# EAGLE schematic Design2 (EAGLE 9.5.0)

## Sheet 1 of 2
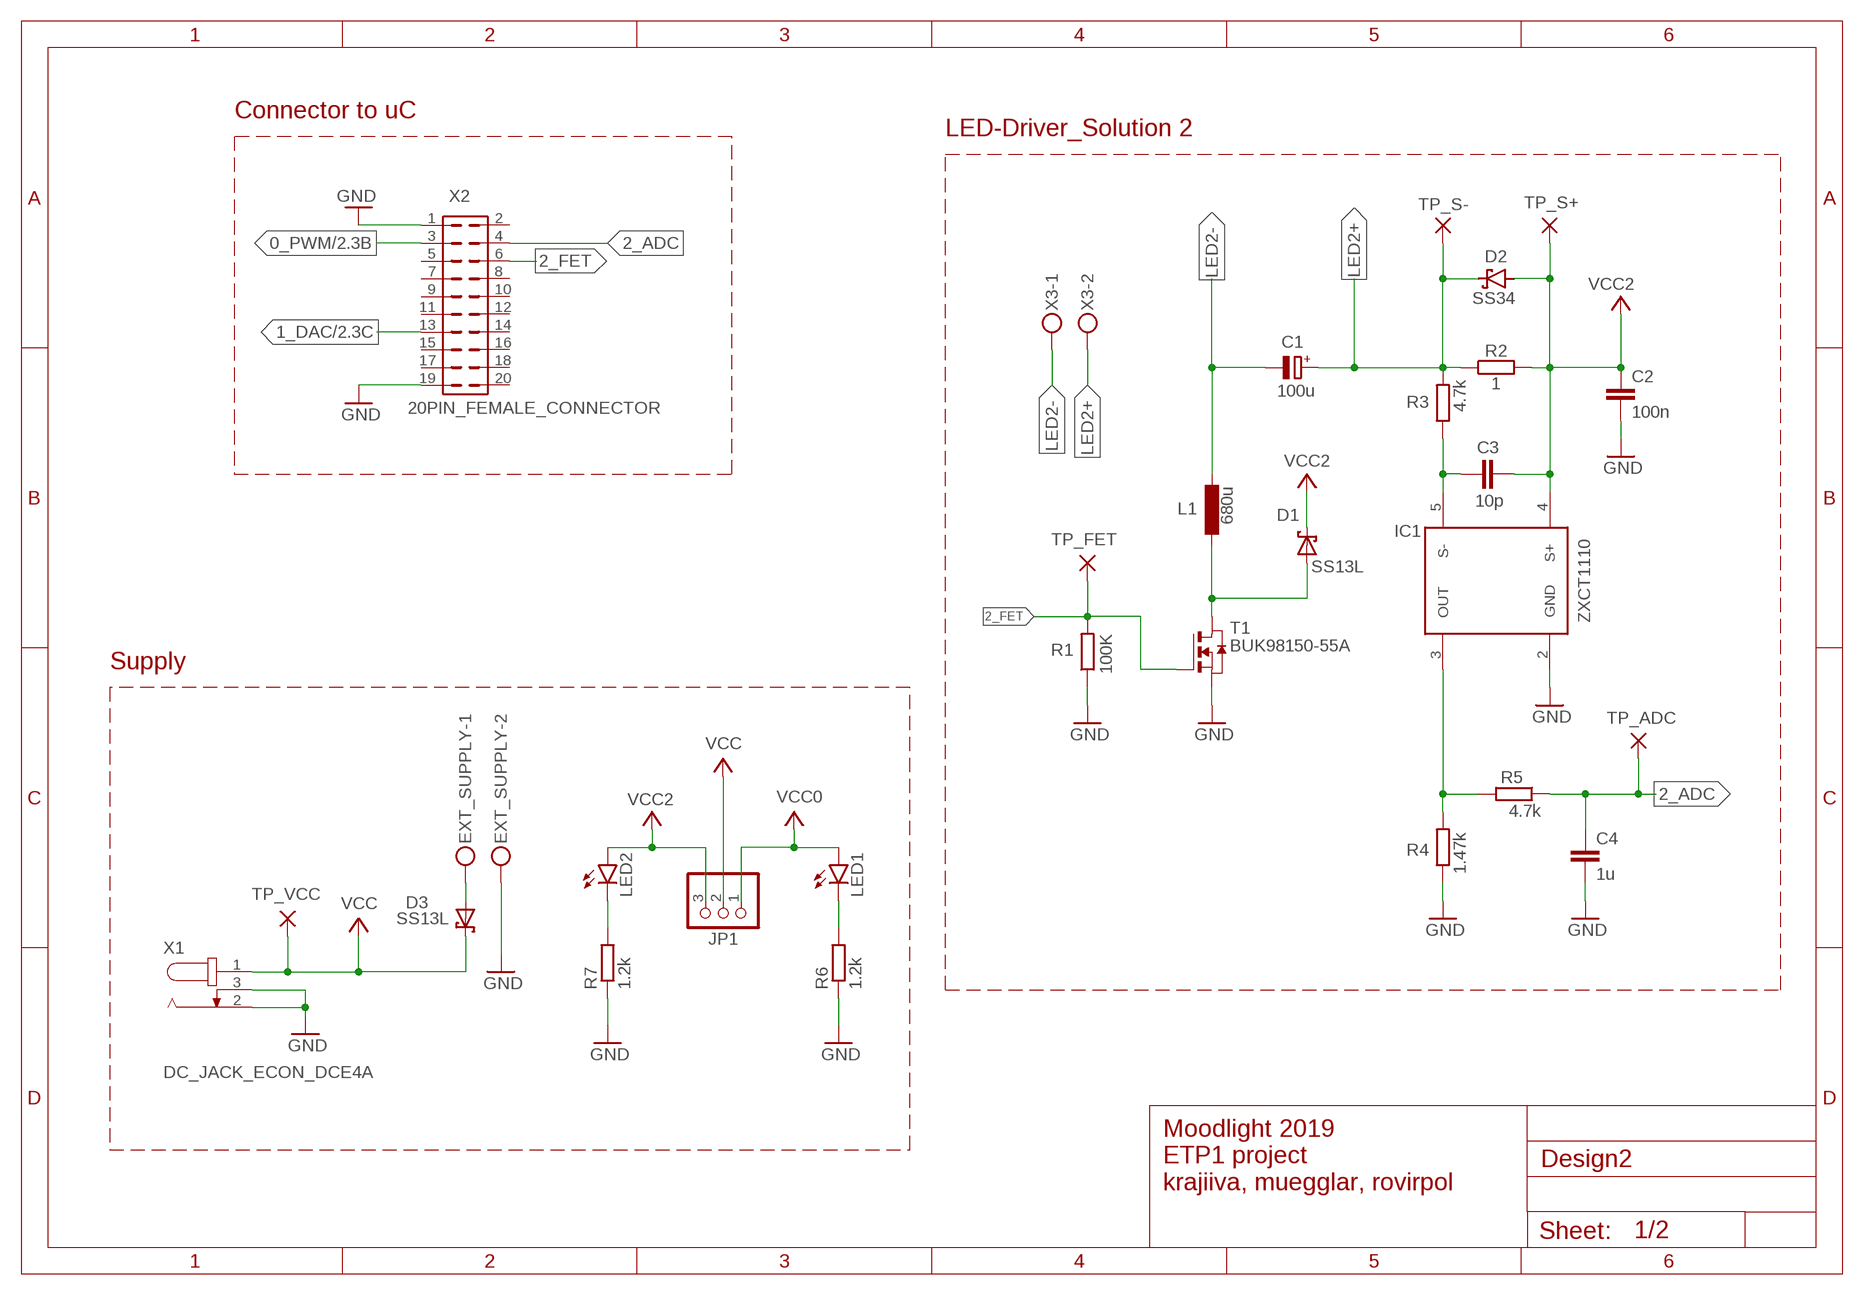
[diagram p0: schematic, sheet 1]

### Parts
C1  100u  CPOL-EUE3.5-8  [E3,5-8]
C2  100n  C-EUC0805K  [C0805K]
C3  10p  C-EUC0805K  [C0805K]
C4  1u  C-EUC0805K  [C0805K]
D1  SS13L  [SUB-SMA]
D2  SS34  SCHOTTKY-DIODESMC  [SMC]
D3  SS13L  [SUB-SMA]
EXT_SUPPLY  MKDSN1,5/2-5,08  [MKDSN1,5/2-5,08]
IC1  ZXCT1110  [SOT23-5]
JP1  PINHD-1X3  [1X03]
L1  680u  POWER-CHOKE_WE-PD  [POWER-CHOKE_WE-PD]
LED1  LED3MM  [LED3MM]
LED2  LED3MM  [LED3MM]
R1  100K  R-EU_R0805  [R0805]
R2  1  R-EU_R1206  [R1206]
R3  4.7k  R-EU_R0805  [R0805]
R4  1.47k  R-EU_R0805  [R0805]
R5  4.7k  R-EU_R0805  [R0805]
R6  1.2k  R-EU_R0805  [R0805]
R7  1.2k  R-EU_R0805  [R0805]
T1  BUK98150-55A  [SOT223]
TP_ADC  WIREPAD4,16O1,6  [4,16O1,6]
TP_FET  WIREPAD4,16O1,6  [4,16O1,6]
TP_S+  WIREPAD4,16O1,6  [4,16O1,6]
TP_S-  WIREPAD4,16O1,6  [4,16O1,6]
TP_VCC  WIREPAD4,16O1,6  [4,16O1,6]
X1  DC_JACK_ECON_DCE4A  [DC_JACK_ECON_DCE4A]
X2  20PIN_FEMALE_CONNECTOR  [20PIN_FEMALE_CONNECTOR]
X3  MKDSN1,5/2-5,08  [MKDSN1,5/2-5,08]

### Nets
0_PWM: X2.3 ; also sheet 2
1_DAC: X2.13 ; also sheet 2
2_ADC: C4.1 R5.1 TP_ADC.1(P) X2.4
2_FET: R1.2 T1.1(G) TP_FET.1(P) X2.6
A: D3.A EXT_SUPPLY.1
GND: C2.2 C4.2 EXT_SUPPLY.2 IC1.2(GND) R1.1 R4.1 R6.1 R7.1 T1.3(S) X1.2 X1.3 X2.1 X2.19 ; also sheet 2
LED2+: C1.+ D2.C R2.1 R3.2 TP_S-.1(P) X3.2
LED2-: C1.- L1.1 X3.1
N$1: LED1.K(C) R6.2
N$2: LED2.K(C) R7.2
N$4: IC1.3(OUT) R4.2 R5.2
N$6: C3.1 IC1.5(S-) R3.1
N$165: D1.A L1.2 T1.2(D) T1.4(D)
VCC: D3.C JP1.2 TP_VCC.1(P) X1.1 ; supply symbol labelled VCC2
VCC0: JP1.1 LED1.A ; supply symbol labelled VCC ; also sheet 2
VCC2: C2.1 C3.2 D1.C D2.A IC1.4(S+) JP1.3 LED2.A R2.2 TP_S+.1(P) ; supply symbol labelled VCC
Unconnected: X2.2 X2.5 X2.7 X2.8 X2.9 X2.10 X2.11 X2.12 X2.14 X2.15 X2.16 X2.17 X2.18 X2.20

### Notes on the sheet
- Connector to uC
- LED-Driver_Solution 2
- Supply
- Moodlight 2019
  ETP1 project 
  krajiiva, muegglar, rovirpol

## Sheet 2 of 2
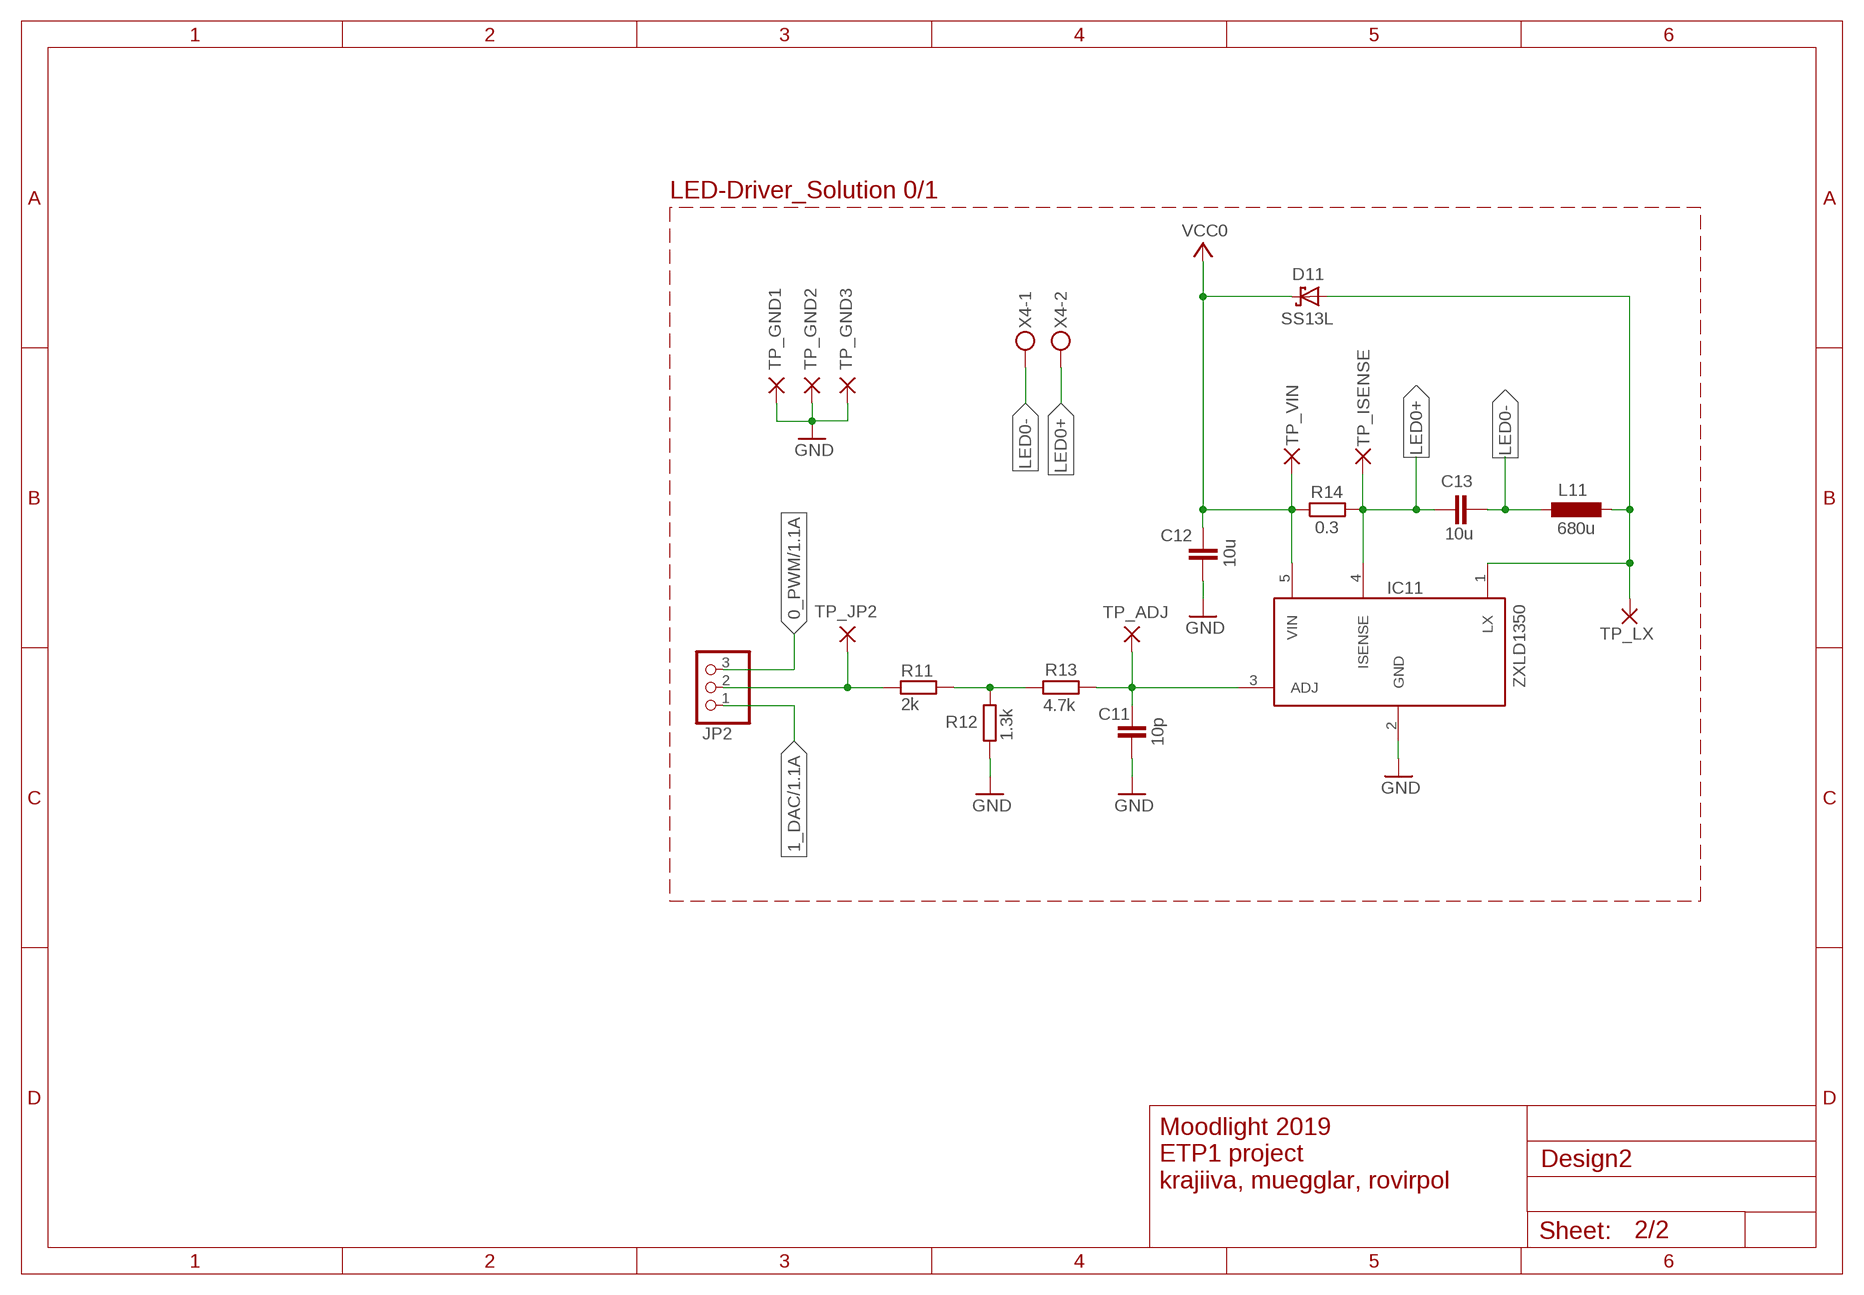
[diagram p1: schematic, sheet 2]

### Parts
C11  10p  C-EUC0805K  [C0805K]
C12  10u  C-EUC0805K  [C0805K]
C13  10u  C-EUC0805K  [C0805K]
D11  SS13L  [SUB-SMA]
IC11  ZXLD1350  [TSOT23-5L]
JP2  PINHD-1X3  [1X03]
L11  680u  POWER-CHOKE_WE-PD  [POWER-CHOKE_WE-PD]
R11  2k  R-EU_R0805  [R0805]
R12  1.3k  R-EU_R0805  [R0805]
R13  4.7k  R-EU_R0805  [R0805]
R14  0.3  R-EU_R1206  [R1206]
TP_ADJ  WIREPAD4,16O1,6  [4,16O1,6]
TP_GND1  WIREPAD4,16O1,6  [4,16O1,6]
TP_GND2  WIREPAD4,16O1,6  [4,16O1,6]
TP_GND3  WIREPAD4,16O1,6  [4,16O1,6]
TP_ISENSE  WIREPAD4,16O1,6  [4,16O1,6]
TP_JP2  WIREPAD4,16O1,6  [4,16O1,6]
TP_LX  WIREPAD4,16O1,6  [4,16O1,6]
TP_VIN  WIREPAD4,16O1,6  [4,16O1,6]
X4  MKDSN1,5/2-5,08  [MKDSN1,5/2-5,08]

### Nets
0_ADJUST: JP2.2 R11.1 TP_JP2.1(P)
0_PWM: JP2.3 ; also sheet 1
1_DAC: JP2.1 ; also sheet 1
GND: C11.2 C12.2 IC11.2(GND) R12.1 TP_GND1.1(P) TP_GND2.1(P) TP_GND3.1(P) ; also sheet 1
LED0+: C13.1 IC11.4(ISENSE) R14.2 TP_ISENSE.1(P) X4.2
LED0-: C13.2 L11.1 X4.1
N$3: R11.2 R12.2 R13.2
N$8: D11.A IC11.1(LX) L11.2 TP_LX.1(P)
N$9: C11.1 IC11.3(ADJ) R13.1 TP_ADJ.1(P)
VCC0: C12.1 D11.C IC11.5(VIN) R14.1 TP_VIN.1(P) ; also sheet 1

### Notes on the sheet
- LED-Driver_Solution 0/1
- Moodlight 2019
  ETP1 project 
  krajiiva, muegglar, rovirpol

## Library data of the parts
C1 = rcl:CPOL-EU: POLARIZED CAPACITOR, European symbol; SPICEPREFIX: C
C2-C4 C11-C13 = rcl:C-EU: CAPACITOR, European symbol; SPICEPREFIX: C
D1 D3 D11 = Moodlight:SS13L: Schottky-Diode 1A/30V
D2 = diode:SCHOTTKY-DIODE: Schottky Diode
EXT_SUPPLY X3 X4 = con-phoenix-508:MKDSN1,5/2-5,08: MKDSN 1,5/ 2-5,08 Printklemme Nennstrom: 13,5 A Nennspannung: 250 V Rastermaß: 5,08 mm Polzahl: 2 Anschlussart: Schraubanschluss Montage: Löten Anschlussrichtung Leiter/Platine: 0 ° Artikelnummer: 1729128 Source: http://eshop.phoenixcontact.com .. 1729128.pdf
IC1 = Moodlight:ZXCT1110: ZXCT1110 LOW POWER HIGH-SIDE CURRENT MONITOR
IC11 = Moodlight:ZXLD1350: ZXLD1350 30V 350mA LED DRIVER with AEC-Q100
JP1 JP2 = pinhead:PINHD-1X3: PIN HEADER
L1 L11 = Moodlight:POWER-CHOKE_WE-PD: POWER-CHOKE_WE-PD
LED1 LED2 = led:LED: LED OSRAM: - CHIPLED LG R971, LG N971, LY N971, LG Q971, LY Q971, LO R971, LY R971 LH N974, LH R974 LS Q976, LO Q976, LY Q976 LO Q996 - Hyper CHIPLED LW Q18S LB Q993, LB Q99A, LB R99A - SideLED LS A670, LO A670, LY A670, LG A670, LP A670 LB A673, LV A673, LT A673, LW A673 LH A674 LY A675 LS A676, LA A676, LO A676, LY A676, LW A676 LS A679, LY A679, LG A679 - Hyper Micro SIDELED® LS Y876, LA Y876, LO Y876, LY Y876 LT Y87S - SmartLED LW L88C, LW L88S LB L89C, LB L89S, LG L890 LS L89K, LO L89K, LY L89K LS L896, LA L896, LO L896, LY L896 - TOPLED LS T670, LO T670, LY T670, LG T670, LP T670 LSG T670, LSP T670, LSY T670, LOP T670, LYG T670 LG T671, LOG T671, LSG T671 LB T673, LV T673, LT T673, LW T673 LH T674 LS T676, LA T676, LO T676, LY T676, LB T676, LH T676, LSB T676, LW T676 LB T67C, LV T67C, LT T67C, LS T67K, LO T67K, LY T67K, LW E67C LS E67B, LA E67B, LO E67B, LY E67B, LB E67C, LV E67C, LT E67C LW T67C LS T679, LY T679, LG T679 LS T770, LO T770, LY T770, LG T770, LP T770 LB T773, LV T773, LT T773, LW T773 LH T774 LS E675, LA E675, LY E675, LS T675 LS T776, LA T776, LO T776, LY T776, LB T776 LHGB T686 LT T68C, LB T68C - Hyper Mini TOPLED® LB M676 - Mini TOPLED Santana® LG M470 LS M47K, LO M47K, LY M47K Source: http://www.osram.convergy.de LUXEON: - LUMILED® LXK2-PW12-R00, LXK2-PW12-S00, LXK2-PW14-U00, LXK2-PW14-V00 LXK2-PM12-R00, LXK2-PM12-S00, LXK2-PM14-U00 LXK2-PE12-Q00, LXK2-PE12-R00, LXK2-PE12-S00, LXK2-PE14-T00, LXK2-PE14-U00 LXK2-PB12-K00, LXK2-PB12-L00, LXK2-PB12-M00, LXK2-PB14-N00, LXK2-PB14-P00, LXK2-PB14-Q00 LXK2-PR12-L00, LXK2-PR12-M00, LXK2-PR14-Q00, LXK2-PR14-R00 LXK2-PD12-Q00, LXK2-PD12-R00, LXK2-PD12-S00 LXK2-PH12-R00, LXK2-PH12-S00 LXK2-PL12-P00, LXK2-PL12-Q00, LXK2-PL12-R00 Source: www.luxeon.com KINGBRIGHT: KA-3528ASYC Source: www.kingbright.com
R1-R7 R11-R14 = rcl:R-EU_: RESISTOR, European symbol; SPICEPREFIX: R
T1 = Moodlight:BUK98150-55A: n-Kanal-MOS-FET; OC_FARNELL: unknown; OC_NEWARK: unknown
TP_ADC TP_ADJ TP_FET TP_GND1-TP_GND3 TP_ISENSE TP_JP2 TP_LX TP_S+ TP_S- TP_VCC TP_VIN = wirepad:WIREPAD: Wire PAD connect wire on PCB
X1 = Moodlight:DC_JACK_ECON_DCE4A: DC_JACK_ECON_DCE4A
X2 = Moodlight:20PIN_FEMALE_CONNECTOR: Buchsenleiste 20Pol 90°